# Altium schematic sheet 4_digit_7_seg.SchDoc
size A3; SheetNumber: 1; SheetTotal: 2
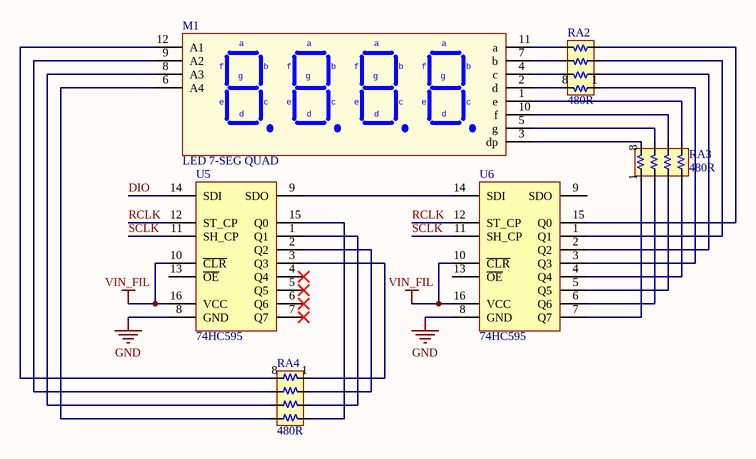
[diagram p0: 4_digit_7_seg.SchDoc]

## Parts
M1  LED 7-SEG QUAD  [LED/7SEG/0.56/QUAD]
RA2  480R  [RA4 1206 (3216)]
RA3  480R  [RA4 1206 (3216)]
RA4  480R  [RA4 1206 (3216)]
U5  74HC595  [SOIC-16]
U6  74HC595  [SOIC-16]

## Nets
GND: U5.8(GND) U6.8(GND)
VIN_FIL: U5.10(~{CLR}) U5.16(VCC) U6.10(~{CLR}) U6.16(VCC)
DIO: U5.14(SDI)
RCLK: U5.12(ST_CP) U6.12(ST_CP)
SCLK: U5.11(SH_CP) U6.11(SH_CP)
NetM1_1: M1.1(e) RA3.5
NetM1_2: M1.2(d) RA2.8
NetM1_3: M1.3(dp) RA3.8
NetM1_4: M1.4(c) RA2.7
NetM1_5: M1.5(g) RA3.7
NetM1_6: M1.6(A4) RA4.5
NetM1_7: M1.7(b) RA2.6
NetM1_8: M1.8(A3) RA4.6
NetM1_9: M1.9(A2) RA4.7
NetM1_10: M1.10(f) RA3.6
NetM1_11: M1.11(a) RA2.5
NetM1_12: M1.12(A1) RA4.8
NetRA2_1: RA2.1 U6.3(Q3)
NetRA2_2: RA2.2 U6.2(Q2)
NetRA2_3: RA2.3 U6.1(Q1)
NetRA2_4: RA2.4 U6.15(Q0)
NetRA3_1: RA3.1 U6.7(Q7)
NetRA3_2: RA3.2 U6.6(Q6)
NetRA3_3: RA3.3 U6.5(Q5)
NetRA3_4: RA3.4 U6.4(Q4)
NetRA4_1: RA4.1 U5.3(Q3)
NetRA4_2: RA4.2 U5.2(Q2)
NetRA4_3: RA4.3 U5.1(Q1)
NetRA4_4: RA4.4 U5.15(Q0)
NetU5_9: U5.9(SDO) U6.14(SDI)

Not connected (* = marked no-connect by the designer): U5 4(Q4)* 5(Q5)* 6(Q6)* 7(Q7)* 13(~{OE}); U6 9(SDO) 13(~{OE})

## Library data of the parts
M1 = LED 7-SEG QUAD: LED 7-SEG 0.56 QUAD RED
RA2-RA4 = Resistor Array 4
U5 U6 = 74HC595: 8-bit serial-in, serial or parallel-out  shift register with output latches;  3-state